# Altium project B100.PrjPcb (part 3 of 3)

## Sheet FOTA MicroController.SchDoc: FOTA MicroController
size A3; ApprovedBy: Mehmet Günce Akkoyun; CheckedBy: Mehmet Günce Akkoyun; Author: Mehmet Günce Akkoyun; CompanyName: Ovoo Electronics; DrawnBy: Mehmet Günce Akkoyun; Engineer: Mehmet Günce Akkoyun; Organization: Ovoo Electronics; Address1: Necip Fazýl Mah. Ortaýrmak Sok.; Address2: Birgül Apt. No: 19/6; Address3: Meram / Konya; Address4: Turkiye; DocumentNumber: 45; Revision: R06; SheetNumber: 45; SheetTotal: 54
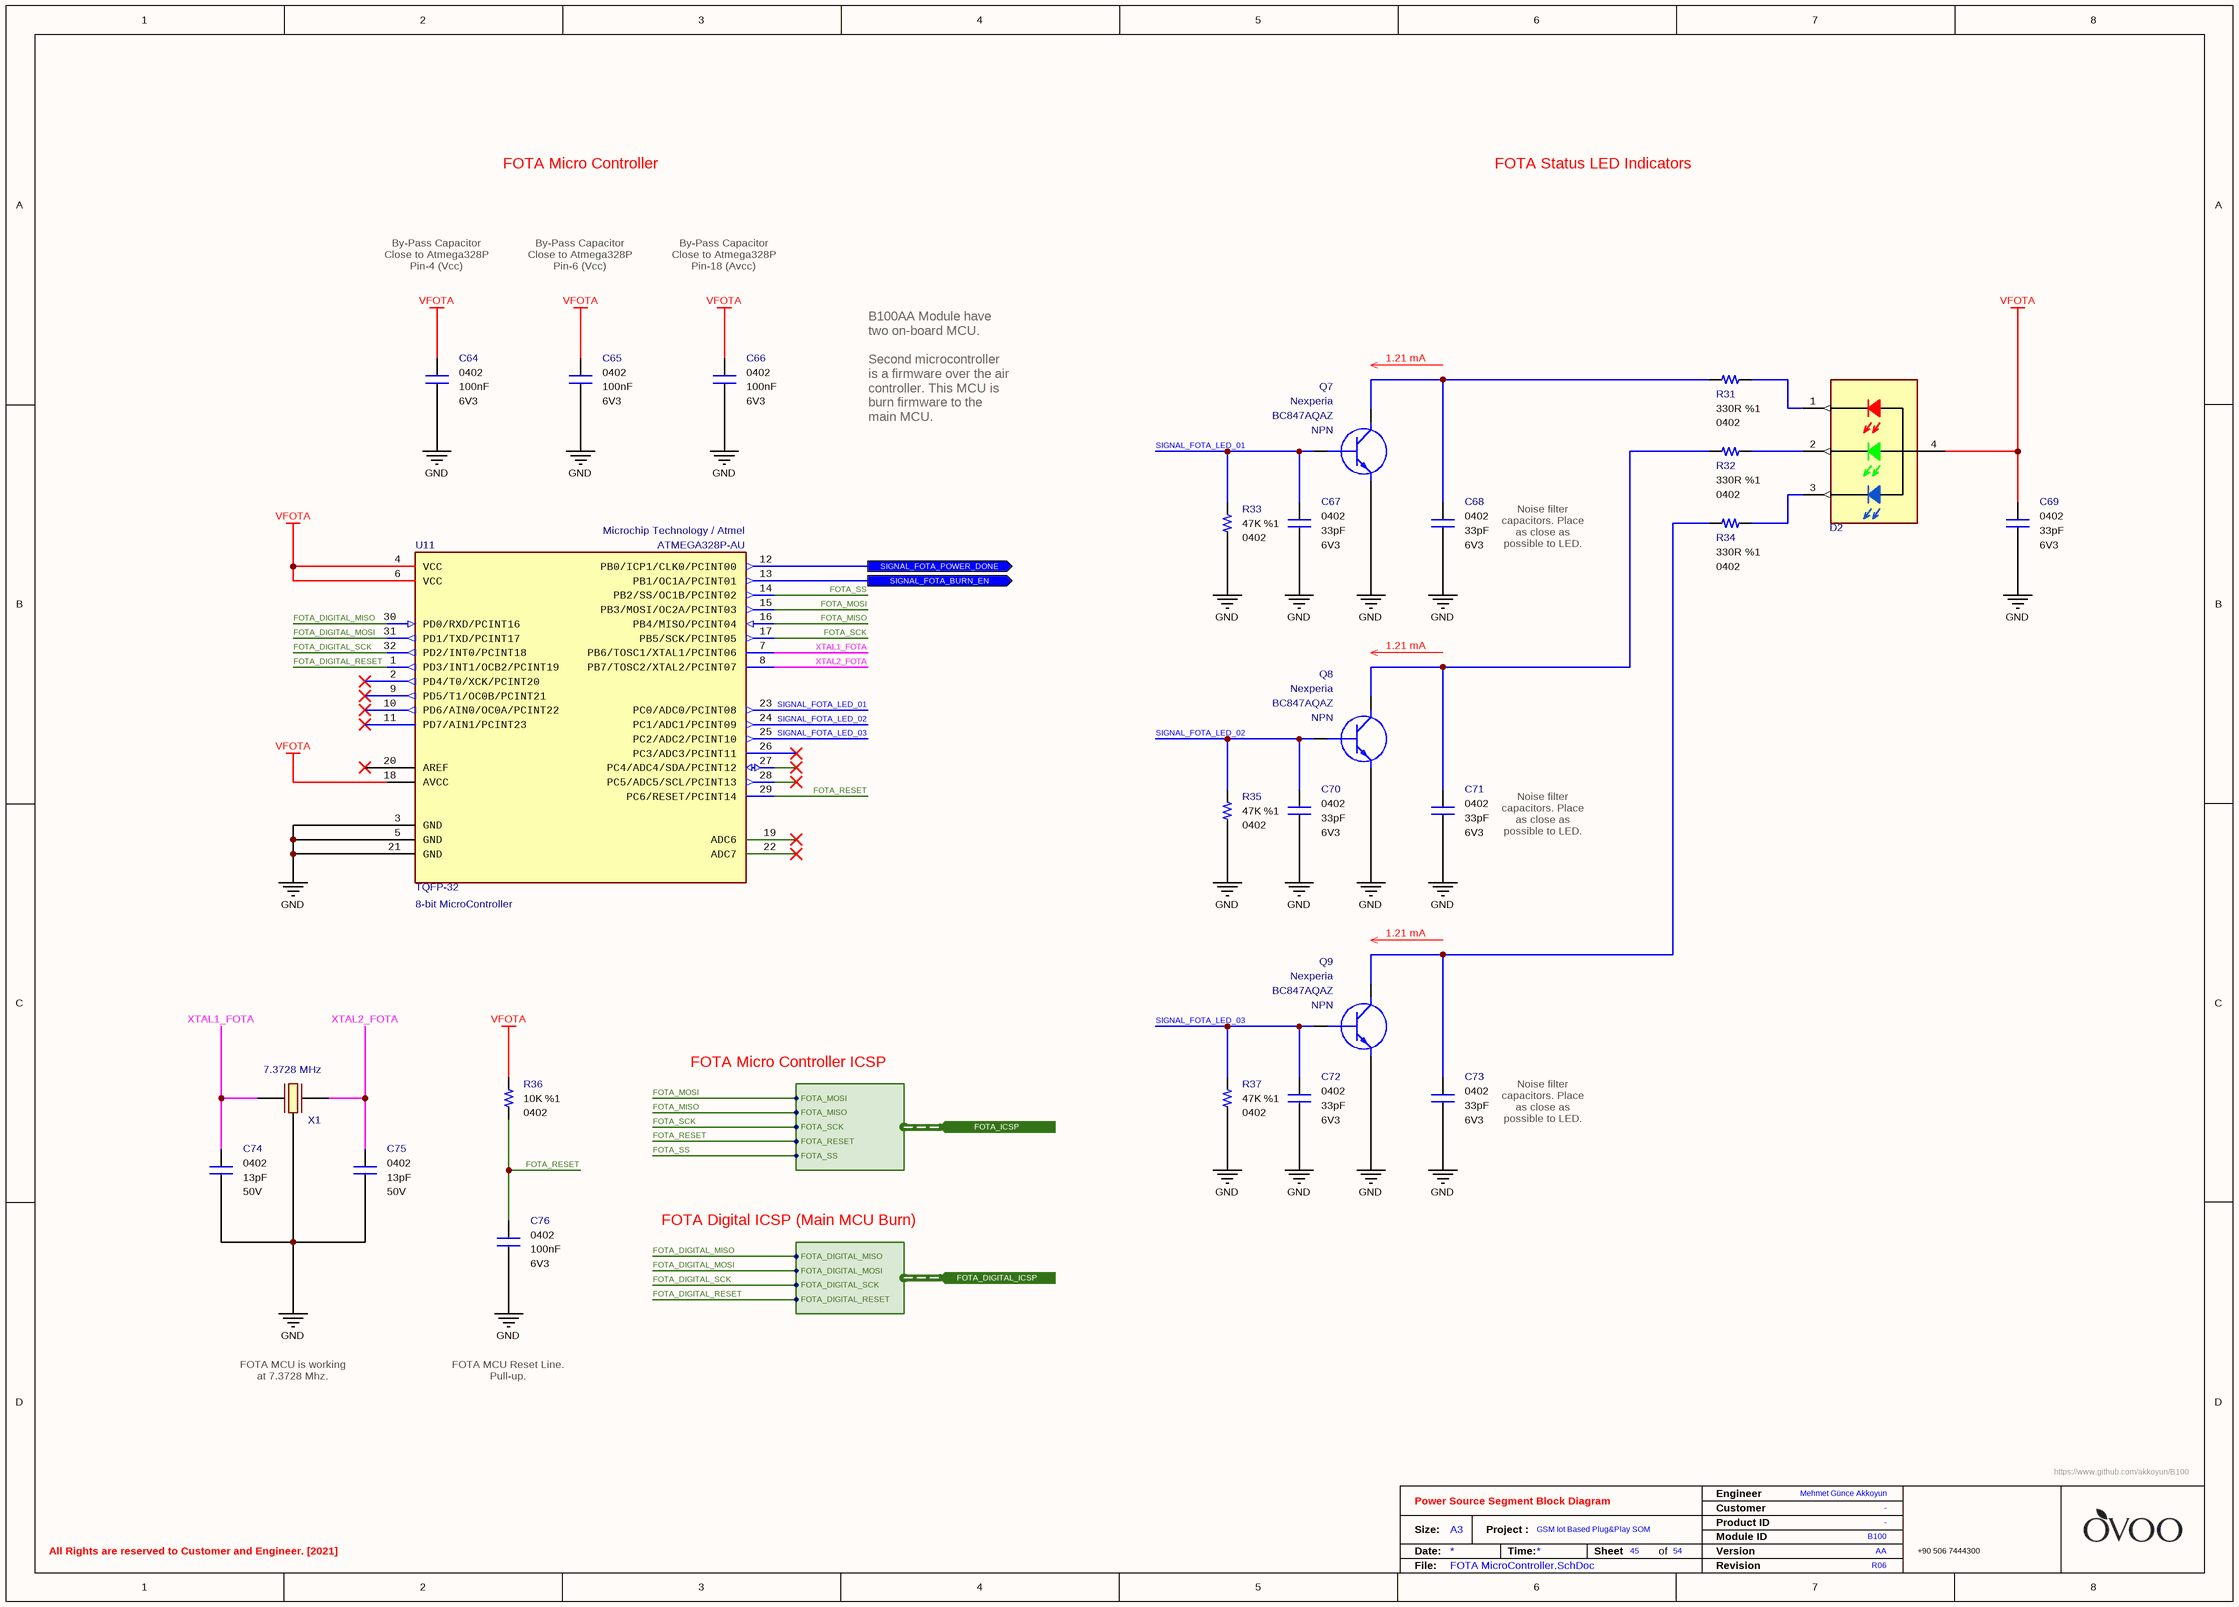
[diagram p21: FOTA MicroController.SchDoc]

### Parts
C64  value 100nF  Case: 0402  Voltage: 6V3  [CAPACITOR_0402]  (hidden comment: Multilayer Ceramic Capacitor)
C65  value 100nF  Case: 0402  Voltage: 6V3  [CAPACITOR_0402]  (hidden comment: Multilayer Ceramic Capacitor)
C66  value 100nF  Case: 0402  Voltage: 6V3  [CAPACITOR_0402]  (hidden comment: Multilayer Ceramic Capacitor)
C67  value 33pF  Case: 0402  Voltage: 6V3  [CAPACITOR_0402]  (hidden comment: Multilayer Ceramic Capacitor)
C68  value 33pF  Case: 0402  Voltage: 6V3  [CAPACITOR_0402]  (hidden comment: Multilayer Ceramic Capacitor)
C69  value 33pF  Case: 0402  Voltage: 6V3  [CAPACITOR_0402]  (hidden comment: Multilayer Ceramic Capacitor)
C70  value 33pF  Case: 0402  Voltage: 6V3  [CAPACITOR_0402]  (hidden comment: Multilayer Ceramic Capacitor)
C71  value 33pF  Case: 0402  Voltage: 6V3  [CAPACITOR_0402]  (hidden comment: Multilayer Ceramic Capacitor)
C72  value 33pF  Case: 0402  Voltage: 6V3  [CAPACITOR_0402]  (hidden comment: Multilayer Ceramic Capacitor)
C73  value 33pF  Case: 0402  Voltage: 6V3  [CAPACITOR_0402]  (hidden comment: Multilayer Ceramic Capacitor)
C74  value 13pF  Voltage: 50V  Case: 0402  [CAPACITOR_0402]  (hidden comment: Multilayer Ceramic Capacitor)
C75  value 13pF  Voltage: 50V  Case: 0402  [CAPACITOR_0402]  (hidden comment: Multilayer Ceramic Capacitor)
C76  value 100nF  Case: 0402  Voltage: 6V3  [CAPACITOR_0402]  (hidden comment: Multilayer Ceramic Capacitor)
D2  150066M153000  [Wurth_0606]  (value not drawn)
Q7  Manufacturer_Name: Nexperia  Manufacturer_Part_Number: BC847AQAZ  Polarity: NPN  [SOT1215]  (hidden comment: Bipolar NPN Transistors)
Q8  Manufacturer_Name: Nexperia  Manufacturer_Part_Number: BC847AQAZ  Polarity: NPN  [SOT1215]  (hidden comment: Bipolar NPN Transistors)
Q9  Manufacturer_Name: Nexperia  Manufacturer_Part_Number: BC847AQAZ  Polarity: NPN  [SOT1215]  (hidden comment: Bipolar NPN Transistors)
R31  value 330R  Tolerance: %1  Case: 0402  [RESISTOR_0402]  (hidden comment: Thick Film Resistor)
R32  value 330R  Tolerance: %1  Case: 0402  [RESISTOR_0402]  (hidden comment: Thick Film Resistor)
R33  value 47K  Tolerance: %1  Case: 0402  [RESISTOR_0402]  (hidden comment: Thick Film Resistor)
R34  value 330R  Tolerance: %1  Case: 0402  [RESISTOR_0402]  (hidden comment: Thick Film Resistor)
R35  value 47K  Tolerance: %1  Case: 0402  [RESISTOR_0402]  (hidden comment: Thick Film Resistor)
R36  value 10K  Tolerance: %1  Case: 0402  [RESISTOR_0402]  (hidden comment: Thick Film Resistor)
R37  value 47K  Tolerance: %1  Case: 0402  [RESISTOR_0402]  (hidden comment: Thick Film Resistor)
U11  8-bit MicroController  Case: TQFP-32  Manufacturer Part Number: ATMEGA328P-AU  Manufacturer Name: Microchip Technology / Atmel  [TQFP32]
X1  7.3728 MHz  [ABRACON_CRYSTAL]

### Ports
FOTA_DIGITAL_ICSP (in, harness FOTA_DIGITAL_ICSP), FOTA_ICSP (in, harness FOTA_ICSP), SIGNAL_FOTA_BURN_EN (out), SIGNAL_FOTA_POWER_DONE (out)

### Harnesses
FOTA_ICSP: FOTA_RESET, FOTA_SCK, FOTA_MISO, FOTA_MOSI, FOTA_SS
FOTA_DIGITAL_ICSP: FOTA_DIGITAL_SCK, FOTA_DIGITAL_MOSI, FOTA_DIGITAL_MISO, FOTA_DIGITAL_RESET

### Nets
GND: C64.1 C65.1 C66.1 C67.2 C68.2 C69.2 C70.2 C71.2 C72.2 C73.2 C74.1 C75.1 C76.1 Q7.2(E) Q8.2(E) Q9.2(E) R33.1 R35.1 R37.1 U11.3(GND) U11.5(GND) U11.21(GND) X1.2(GND)
VFOTA: C64.2 C65.2 C66.2 C69.1 D2.4 R36.2 U11.4(VCC) U11.6(VCC) U11.18(AVCC)
FOTA_DIGITAL_MISO: U11.30(PD0/RXD/PCINT16) ; port FOTA_DIGITAL_ICSP.FOTA_DIGITAL_MISO
FOTA_DIGITAL_MOSI: U11.31(PD1/TXD/PCINT17) ; port FOTA_DIGITAL_ICSP.FOTA_DIGITAL_MOSI
FOTA_DIGITAL_RESET: U11.1(PD3/INT1/OCB2/PCINT19) ; port FOTA_DIGITAL_ICSP.FOTA_DIGITAL_RESET
FOTA_DIGITAL_SCK: U11.32(PD2/INT0/PCINT18) ; port FOTA_DIGITAL_ICSP.FOTA_DIGITAL_SCK
FOTA_MISO: U11.16(PB4/MISO/PCINT04) ; port FOTA_ICSP.FOTA_MISO
FOTA_MOSI: U11.15(PB3/MOSI/OC2A/PCINT03) ; port FOTA_ICSP.FOTA_MOSI
FOTA_RESET: C76.2 R36.1 U11.29(PC6/RESET/PCINT14) ; port FOTA_ICSP.FOTA_RESET
FOTA_SCK: U11.17(PB5/SCK/PCINT05) ; port FOTA_ICSP.FOTA_SCK
FOTA_SS: U11.14(PB2/SS/OC1B/PCINT02) ; port FOTA_ICSP.FOTA_SS
SIGNAL_FOTA_LED_01: C67.1 Q7.1(B) R33.2 U11.23(PC0/ADC0/PCINT08)
SIGNAL_FOTA_LED_02: C70.1 Q8.1(B) R35.2 U11.24(PC1/ADC1/PCINT09)
SIGNAL_FOTA_LED_03: C72.1 Q9.1(B) R37.2 U11.25(PC2/ADC2/PCINT10)
XTAL1_FOTA: C74.2 U11.7(PB6/TOSC1/XTAL1/PCINT06) X1.3(OUT/IN)
XTAL2_FOTA: C75.2 U11.8(PB7/TOSC2/XTAL2/PCINT07) X1.1(IN/OUT)
NetC68_1: C68.1 Q7.3(C) R31.1
NetC71_1: C71.1 Q8.3(C) R32.1
NetC73_1: C73.1 Q9.3(C) R34.1
NetD2_1: D2.1 R31.2
NetD2_2: D2.2 R32.2
NetD2_3: D2.3 R34.2
NetU11_12: U11.12(PB0/ICP1/CLK0/PCINT00) ; port SIGNAL_FOTA_POWER_DONE
NetU11_13: U11.13(PB1/OC1A/PCINT01) ; port SIGNAL_FOTA_BURN_EN

Not connected (* = marked no-connect by the designer): U11 2(PD4/T0/XCK/PCINT20)* 9(PD5/T1/OC0B/PCINT21)* 10(PD6/AIN0/OC0A/PCINT22)* 11(PD7/AIN1/PCINT23)* 19(ADC6)* 20(AREF)* 22(ADC7)* 26(PC3/ADC3/PCINT11)* 27(PC4/ADC4/SDA/PCINT12)* 28(PC5/ADC5/SCL/PCINT13)*; X1 4(GND)

### Notes on the sheet
- FOTA Micro Controller
- FOTA Status LED Indicators
- By-Pass Capacitor
  Close to Atmega328P
  Pin-4 (Vcc)
- By-Pass Capacitor
  Close to Atmega328P
  Pin-6 (Vcc)
- By-Pass Capacitor
  Close to Atmega328P
  Pin-18 (Avcc)
- 1.21 mA
- B100AA Module have two on-board MCU.
  Second microcontroller is a firmware over the air controller. This MCU is burn firmware to the main MCU.
- Noise filter capacitors. Place as close as possible to LED.
- FOTA Micro Controller ICSP
- FOTA Digital ICSP (Main MCU Burn)
- FOTA MCU is working at 7.3728 Mhz.
- FOTA MCU Reset Line. Pull-up.
- Engineer
- All Rights are reserved to Customer and Engineer. [2021]
- Size:
- Date:
- A3
- Project :
- Time:
- Sheet
- of
- Customer
- Product ID
- Module ID
- Version
- File:
- Revision

### Library data of the parts
C64-C66 C76 = Capacitor - 100nF [0402-6V3]: Capacitor - 100nF [0402-6V3] (Ceramic); Manufacturer Name: AVX; Manufacturer Part Number: 04026D104KAT4A; Dielectric: X5R; Tolerance: %10; Height: 0.25mm; ComponentLink1Description: Mouser; ComponentLink1URL: https://www.mouser.com.tr/ProductDetail/AVX/04026D104KAT4A?qs=sGAEpiMZZMs0AnBnWHyRQPg4iYkCw7IMED%2F4kpqgf7w%3D; ComponentLink2Description: DataSheet; ComponentLink2URL: https://www.mouser.com.tr/datasheet/2/40/cx5r-776519.pdf; ROHS: Yes; Maximum Operating Temperature: +85; Minimum Operating Temperature: -55; Supplier 1: Avnet; Supplier Part Number 1: 04026D104KAT4A; Mouser Part Number: 581-04026D104KAT4A
C67-C73 = Capacitor - 33pF [0402-6V3]: Capacitor - 33pF [0402] (Ceramic); Manufacturer Name: Kemet; Manufacturer Part Number: C0402C330J9RACAUTO; Dielectric: X7R; Tolerance: 10%; Height: 0.5mm; Maximum Operating Temperature: +125; Minimum Operating Temperature: -55; ROHS: Yes; ComponentLink1Description: DataSheet; ComponentLink1URL: https://api.kemet.com/component-edge/download/datasheet/C0402C330J9RACAUTO.pdf; ComponentLink2Description: Mouser; ComponentLink2URL: https://www.mouser.com/Search/Refine.aspx?Keyword=80-C0402C330J9RAUTO; Supplier 1: Mouser; Supplier Part Number 1: 80-C0402C330J9RAUTO; Mouser Part Number: 80-C0402C330J9RAUTO
C74 C75 = Capacitor - 13pF [0402-50V]: Capacitor - 13pF [0402] (Ceramic); Manufacturer Name: Kemet; Manufacturer Part Number: CBR04C130F5GAC; Dielectric: C0G; Tolerance: 1%; Height: 0.55mm; ROHS: Yes; Weight: 0.65mg; ComponentLink1Description: DataSheet; ComponentLink1URL: http://www.kemet.com/Lists/ProductCatalog/Attachments/490/KEM_C1030_CBR_SMD.pdf; ComponentLink2Description: Mouser; ComponentLink2URL: http://www.mouser.com/Search/ProductDetail.aspx?qs=kSX8PZDGYstn%252bRHasf81FA%3d%3d; Supplier 1: Mouser; Supplier 2: Farnell; Supplier 3: Digi-Key; Supplier Part Number 3: 399-8812-1-ND; Supplier Part Number 2: 2773390; Supplier Part Number 1: 80-CBR04C130F5GAC; Mouser Part Number: 80-CBR04C130F5GAC
D2 = Diode - RGB LED (150066M153000): Standard LEDs - SMD PICOLED series Red LED; Manufacturer Name: Wurth Elektronik; Datasheet Link: https://www.mouser.com.tr/datasheet/2/445/150066M153000-1715259.pdf; Manufacturer Part Number: 150066M153000; Mouser Part Number: 710-150066M153000; Mouser Price/Stock: https://www.mouser.com.tr/ProductDetail/ROHM-Semiconductor/SML-P12U2TT86R?qs=sGAEpiMZZMseGfSY3csMkRIBDsfU3UCXJTULB5gem9Ta%252Bp%252BvZ709fg%3D%3D; Case: 0606; ROHS: Yes; Supplier 1: RSComponents; Supplier 2: RSComponents; Supplier 3: Mouser; Supplier 4: Farnell; Supplier 5: Digi-Key; Supplier 6: Digi-Key; Supplier 7: Digi-Key; Supplier 8: Newark; Supplier Part Number 1: 1765006; Supplier Part Number 2: 1766050; Supplier Part Number 3: 710-150066M153000; Supplier Part Number 4: 2764964; Supplier Part Number 5: 732-11390-1-ND; Supplier Part Number 6: 732-11390-6-ND; Supplier Part Number 7: 732-11390-2-ND; Supplier Part Number 8: 22AC3253
Q7-Q9 = Transistor - BC847: Bipolar Transistors - BJT BC847AQA/DFN1010D-3/REEL 7" Q2; Mouser_Part_Number: 771-BC847AQAZ; ComponentLink1Description: DataSheet; ComponentLink1URL: https://www.mouser.com.tr/datasheet/2/916/BC847XQA_SER-1598405.pdf; ComponentLink2Description: Mouser; ComponentLink2URL: https://www.mouser.com.tr/ProductDetail/Nexperia/BC847AQAZ?qs=%2Fha2pyFaduhKMCPKNtQimeJpXTw9z4AqURd2YARs8DVICZNv3AT9Dw%3D%3D; Case: DFN-1010D-3; Supplier 1: Mouser; Supplier 2: Digi-Key; Supplier Part Number 1: 771-BC847AQAZ; Supplier Part Number 2: 1727-2545-1-ND
R31 R32 R34 = Resistor - 330R: Thick Film Resistors - SMD 1/16 W 330 Ohm 1%; Manufacturer Name: Vishay; Manufacturer Part Number: CRCW0402330RFKED; Height: 0.4mm; ComponentLink1Description: DataSheet; ComponentLink1URL: https://www.mouser.com.tr/datasheet/2/427/dcrcwe3-1762152.pdf; ComponentLink2Description: Mouser; ComponentLink2URL: https://www.mouser.com.tr/ProductDetail/Vishay-Dale/CRCW0402330RFKED?qs=sGAEpiMZZMu61qfTUdNhG2DpbjADlD3GGS6SwBlLi5Q%3D; Supplier 1: Mouser; Supplier 2: Digi-Key; Supplier Part Number 2: 541-330LCT-ND; Supplier Part Number 1: 71-CRCW0402-330-E3; Mouser Part Number: 71-CRCW0402-330-E3
R33 R35 R37 = Resistor - 47K: Thick Film Resistors - SMD 1/16 W 47 Kohms 1%; Manufacturer Name: Vishay; Manufacturer Part Number: CRCW040247K0FKED; Height: 0.4mm; ComponentLink1Description: DataSheet; ComponentLink1URL: https://www.mouser.com.tr/datasheet/2/427/dcrcwe3-1762152.pdf; ComponentLink2Description: Mouser; ComponentLink2URL: https://www.mouser.com.tr/ProductDetail/Vishay-Dale/CRCW040247K0FKED?qs=sGAEpiMZZMu61qfTUdNhG2DpbjADlD3GL%252B3h1elTxqU%3D; Supplier 1: Mouser; Supplier 2: Digi-Key; Supplier Part Number 1: 71-CRCW040247K0FKEDH; Supplier Part Number 2: 541-47.0KYCT-ND; Mouser Part Number: 71-CRCW0402-47K-E3
R36 = Resistor - 10K: Thick Film Resistors - SMD 1/16 W 10 Kohms 1%; Manufacturer Name: Vishay; Manufacturer Part Number: CRCW040210K0FKED; Height: 0.4mm; ComponentLink1Description: DataSheet; ComponentLink1URL: https://www.mouser.com.tr/datasheet/2/427/dcrcwe3-1762152.pdf; ComponentLink2Description: Mouser; ComponentLink2URL: https://www.mouser.com.tr/ProductDetail/Vishay-Dale/CRCW040210K0FKED?qs=sGAEpiMZZMu61qfTUdNhG2DpbjADlD3GcalbOv9utCY%3D; Supplier 1: Mouser; Supplier 2: Digi-Key; Supplier Part Number 1: 71-CRCW040210K0FKEDH; Supplier Part Number 2: 541-10.0KYCT-ND; Mouser Part Number: 71-CRCW0402-10K-E3
U11 = IC - ATMEGA328P: 8-bit Microcontrollers - MCU 32KB In-system Flash 20MHz 1.8V-5.5V; Supply Voltage - Min: 1.8V; Supply Voltage - Max: 5.5V; Height: 1mm; ComponentLink1Description: DataSheet; ComponentLink1URL: http://ww1.microchip.com/downloads/en/DeviceDoc/ATmega48A-PA-88A-PA-168A-PA-328-P-DS-DS40002061A.pdf; ROHS: Yes; Minimum Operating Temperature: -40; Maximum Operating Temperature: +85; ComponentLink2Description: Mouser; ComponentLink2URL: https://www.mouser.com.tr/ProductDetail/Microchip-Technology-Atmel/ATMEGA328P-AU?qs=sGAEpiMZZMtVoztFdqDXO3RbBx7FKCmV; ComponentLink3Description: ProductPage; ComponentLink3URL: https://www.microchip.com/wwwproducts/en/ATmega328p; Supplier 1: Avnet; Supplier 2: Mouser; Supplier 3: Arrow; Supplier 4: Digi-Key; Supplier Part Number 1: ATMEGA328P-AU; Supplier Part Number 2: 556-ATMEGA328P-AU; Supplier Part Number 3: ATMEGA328P-AU; Supplier Part Number 4: ATMEGA328P-AU-ND; Mouser Part Number: 556-ATMEGA328P-AU
X1 = Crystal - 7.3728 MHz (Abracon): Crystals 7.3728MHz 18pF -40C +85C; Manufacturer Part Number: ABMM2-7.3728MHZ-E2-T; ESR: 150 Ohms; Frequency Stability: 20 ppm; Height: 1.2 mm; Frequency: 7.3728 MHz; Maximum Operating Temperature: +70; Minimum Operating Temperature: -20; ROHS: Yes; Tolerance: 20 ppm; ComponentLink1Description: DataSheet; ComponentLink1URL: https://www.ecsxtal.com/store/pdf/csm-8mr.pdf; ComponentLink2Description: Mouser; ComponentLink2URL: https://www.mouser.com/Search/Refine.aspx?Keyword=520-7.3-18-20BM-JENT; Supplier 1: Mouser; Supplier 2: Arrow; Supplier Part Number 2: ABMM2-7.3728MHZ-E2-T; Supplier Part Number 1: 815-ABMM2-7.3-E2-T; Manufacturer Name: ABRACON; Mouser Part Number: 815-ABMM2-7.3-E2-T; Case: SMD

## Sheet SD Card.SchDoc: SD Card & Select Switch
size A4; ApprovedBy: Mehmet Günce Akkoyun; CheckedBy: Mehmet Günce Akkoyun; Author: Mehmet Günce Akkoyun; CompanyName: Ovoo Electronics; DrawnBy: Mehmet Günce Akkoyun; Engineer: Mehmet Günce Akkoyun; Organization: Ovoo Electronics; Address1: Necip Fazýl Mah. Ortaýrmak Sok.; Address2: Birgül Apt. No: 19/6; Address3: Meram / Konya; Address4: Turkiye; DocumentNumber: 46; Revision: R06; SheetNumber: 46; SheetTotal: 54
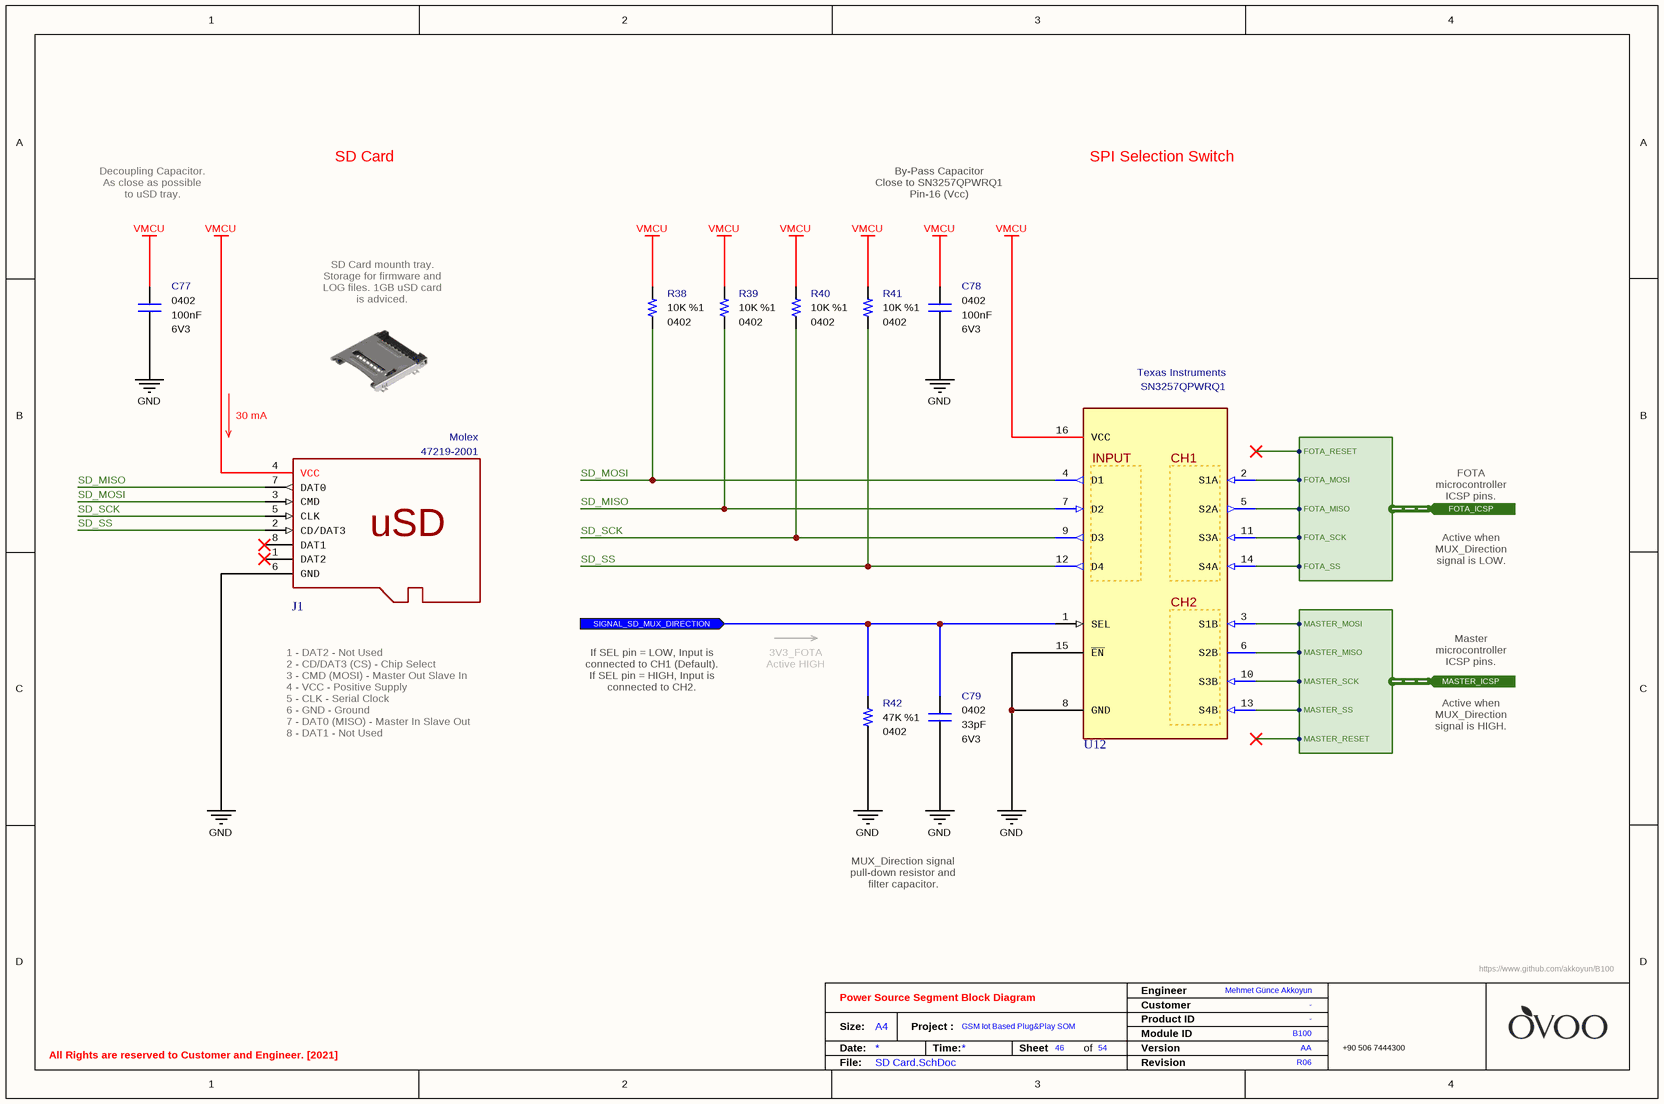
[diagram p22: SD Card.SchDoc]

### Parts
C77  value 100nF  Case: 0402  Voltage: 6V3  [CAPACITOR_0402]  (hidden comment: Multilayer Ceramic Capacitor)
C78  value 100nF  Case: 0402  Voltage: 6V3  [CAPACITOR_0402]  (hidden comment: Multilayer Ceramic Capacitor)
C79  value 33pF  Case: 0402  Voltage: 6V3  [CAPACITOR_0402]  (hidden comment: Multilayer Ceramic Capacitor)
J1  Manufacturer Part Number: 47219-2001  Manufacturer Name: Molex  [Connector - SD Module]  (hidden comment: Memory Card Connectors)
R38  value 10K  Tolerance: %1  Case: 0402  [RESISTOR_0402]  (hidden comment: Thick Film Resistor)
R39  value 10K  Tolerance: %1  Case: 0402  [RESISTOR_0402]  (hidden comment: Thick Film Resistor)
R40  value 10K  Tolerance: %1  Case: 0402  [RESISTOR_0402]  (hidden comment: Thick Film Resistor)
R41  value 10K  Tolerance: %1  Case: 0402  [RESISTOR_0402]  (hidden comment: Thick Film Resistor)
R42  value 47K  Tolerance: %1  Case: 0402  [RESISTOR_0402]  (hidden comment: Thick Film Resistor)
U12  Manufacturer Part Number: SN3257QPWRQ1  Manufacturer Name: Texas Instruments  [TSSOP-16]  (hidden comment: SPI Switch IC)

### Ports
FOTA_ICSP (in, harness FOTA_ICSP), MASTER_ICSP (in, harness MASTER_ICSP), SIGNAL_SD_MUX_DIRECTION (in)

### Harnesses
FOTA_ICSP: FOTA_RESET, FOTA_SCK, FOTA_MISO, FOTA_MOSI, FOTA_SS
MASTER_ICSP: MASTER_RESET, MASTER_SCK, MASTER_MISO, MASTER_MOSI, MASTER_SS

### Nets
GND: C77.1 C78.2 C79.1 J1.6(GND) R42.1 U12.8(GND) U12.15(~{EN})
VMCU: C77.2 C78.1 J1.4(VCC) R38.2 R39.2 R40.2 R41.2 U12.16(VCC)
SD_MISO: J1.7(DAT0) R39.1 U12.7(D2)
SD_MOSI: J1.3(CMD) R38.1 U12.4(D1)
SD_SCK: J1.5(CLK) R40.1 U12.9(D3)
SD_SS: J1.2(CD/DAT3) R41.1 U12.12(D4)
NetC79_2: C79.2 R42.2 U12.1(SEL) ; port SIGNAL_SD_MUX_DIRECTION
NetU12_2: U12.2(S1A) ; port FOTA_ICSP.FOTA_MOSI
NetU12_3: U12.3(S1B) ; port MASTER_ICSP.MASTER_MOSI
NetU12_5: U12.5(S2A) ; port FOTA_ICSP.FOTA_MISO
NetU12_6: U12.6(S2B) ; port MASTER_ICSP.MASTER_MISO
NetU12_10: U12.10(S3B) ; port MASTER_ICSP.MASTER_SCK
NetU12_11: U12.11(S3A) ; port FOTA_ICSP.FOTA_SCK
NetU12_13: U12.13(S4B) ; port MASTER_ICSP.MASTER_SS
NetU12_14: U12.14(S4A) ; port FOTA_ICSP.FOTA_SS

Not connected (* = marked no-connect by the designer): J1 1(DAT2)* 8(DAT1)*

### Notes on the sheet
- SD Card
- SPI Selection Switch
- Decoupling Capacitor. As close as possible to uSD tray.
- By-Pass Capacitor
  Close to SN3257QPWRQ1
  Pin-16 (Vcc)
- SD Card mounth tray. Storage for firmware and LOG files. 1GB uSD card is adviced.
- 30 mA
- FOTA microcontroller
  ICSP pins.
- Active when MUX_Direction signal is LOW.
- If SEL pin = LOW, Input is connected to CH1 (Default).
  If SEL pin = HIGH, Input is connected to CH2.
- (near R42) 3V3_FOTA
  Active HIGH
- Master microcontroller
  ICSP pins.
- 1 - DAT2 - Not Used
  2 - CD/DAT3 (CS) - Chip Select
  3 - CMD (MOSI) - Master Out Slave In
  4 - VCC - Positive Supply
  5 - CLK - Serial Clock
  6 - GND - Ground
  7 - DAT0 (MISO) - Master In Slave Out
  8 - DAT1 - Not Used
- Active when MUX_Direction signal is HIGH.
- MUX_Direction signal pull-down resistor and filter capacitor.
- Engineer
- All Rights are reserved to Customer and Engineer. [2021]
- Size:
- Date:
- A4
- Project :
- Time:
- Sheet
- of
- Customer
- Product ID
- Module ID
- Version
- File:
- Revision
- (in symbol Connector - SD Slot) uSD
- (in symbol IC - SN3257QPWRQ1) INPUT; CH1; CH2

### Library data of the parts
C77 C78 = Capacitor - 100nF [0402-6V3]: as C64-C66 on sheet FOTA MicroController; Height: 0.25mm; ComponentLink1Description: Mouser; ComponentLink1URL: https://www.mouser.com.tr/ProductDetail/AVX/04026D104KAT4A?qs=sGAEpiMZZMs0AnBnWHyRQPg4iYkCw7IMED%2F4kpqgf7w%3D; ComponentLink2Description: DataSheet; ComponentLink2URL: https://www.mouser.com.tr/datasheet/2/40/cx5r-776519.pdf; ROHS: Yes; Maximum Operating Temperature: +85; Minimum Operating Temperature: -55; Supplier 1: Avnet; Supplier Part Number 1: 04026D104KAT4A; Mouser Part Number: 581-04026D104KAT4A
C79 = Capacitor - 33pF [0402-6V3]: as C67-C73 on sheet FOTA MicroController; Height: 0.5mm; Maximum Operating Temperature: +125; Minimum Operating Temperature: -55; ROHS: Yes; ComponentLink1Description: DataSheet; ComponentLink1URL: https://api.kemet.com/component-edge/download/datasheet/C0402C330J9RACAUTO.pdf; ComponentLink2Description: Mouser; ComponentLink2URL: https://www.mouser.com/Search/Refine.aspx?Keyword=80-C0402C330J9RAUTO; Supplier 1: Mouser; Supplier Part Number 1: 80-C0402C330J9RAUTO; Mouser Part Number: 80-C0402C330J9RAUTO
J1 = Connector - SD Slot: Memory Card Connectors TFR READER (HINGE TYPE); Card Type: microSD; Supplier 1: Avnet; Supplier 2: Farnell; Supplier 3: Newark; Supplier 4: Digi-Key; Supplier Part Number 2: 2614940; Supplier Part Number 1: 0472192001; Supplier Part Number 3: 32T4523; Supplier Part Number 4: WM6698CT-ND; Mouser Part Number: 538-47219-2001; Case: SMD
R38-R41 = Resistor - 10K: as R36 on sheet FOTA MicroController; Height: 0.4mm; ComponentLink1Description: DataSheet; ComponentLink1URL: https://www.mouser.com.tr/datasheet/2/427/dcrcwe3-1762152.pdf; ComponentLink2Description: Mouser; ComponentLink2URL: https://www.mouser.com.tr/ProductDetail/Vishay-Dale/CRCW040210K0FKED?qs=sGAEpiMZZMu61qfTUdNhG2DpbjADlD3GcalbOv9utCY%3D; Supplier 1: Mouser; Supplier 2: Digi-Key; Supplier Part Number 1: 71-CRCW040210K0FKEDH; Supplier Part Number 2: 541-10.0KYCT-ND; Mouser Part Number: 71-CRCW0402-10K-E3
R42 = Resistor - 47K: as R33 on sheet FOTA MicroController; Height: 0.4mm; ComponentLink1Description: DataSheet; ComponentLink1URL: https://www.mouser.com.tr/datasheet/2/427/dcrcwe3-1762152.pdf; ComponentLink2Description: Mouser; ComponentLink2URL: https://www.mouser.com.tr/ProductDetail/Vishay-Dale/CRCW040247K0FKED?qs=sGAEpiMZZMu61qfTUdNhG2DpbjADlD3GL%252B3h1elTxqU%3D; Supplier 1: Mouser; Supplier 2: Digi-Key; Supplier Part Number 1: 71-CRCW040247K0FKEDH; Supplier Part Number 2: 541-47.0KYCT-ND; Mouser Part Number: 71-CRCW0402-47K-E3
U12 = IC - SN3257QPWRQ1: Analogue Switch ICs 2:1 (SPDT), 4-channel switch with 1.8-V logic 16-TSSOP -40 to 125; Mouser Part Number: 595-SN3257QPWRQ1; ComponentLink1Description: DataSheet; ComponentLink1URL: http://www.ti.com/lit/ds/symlink/tca9546a.pdf; ComponentLink2Description: Mouser; ComponentLink2URL: https://eu.mouser.com/ProductDetail/Texas-Instruments/TCA9546APWR?qs=sGAEpiMZZMu0f%252BT2bkVfuqY85%252BzcFu6eZaMCXRqwDMg%3D; Minimum Operating Temperature: -40; Maximum Operating Temperature: +125; Supplier 1: Mouser; Supplier 2: Digi-Key; Supplier Part Number 1: 595-SN3257QPWRQ1; Supplier Part Number 2: 296-SN3257QPWRQ1CT-ND; Case: TSSOP-16

## Sheet ICSP Burn Buffer.SchDoc: FOTA Burn Buffer
size A4; ApprovedBy: Mehmet Günce Akkoyun; CheckedBy: Mehmet Günce Akkoyun; Author: Mehmet Günce Akkoyun; CompanyName: Ovoo Electronics; DrawnBy: Mehmet Günce Akkoyun; Engineer: Mehmet Günce Akkoyun; Organization: Ovoo Electronics; Address1: Necip Fazýl Mah. Ortaýrmak Sok.; Address2: Birgül Apt. No: 19/6; Address3: Meram / Konya; Address4: Turkiye; DocumentNumber: 47; Revision: R06; SheetNumber: 47; SheetTotal: 54
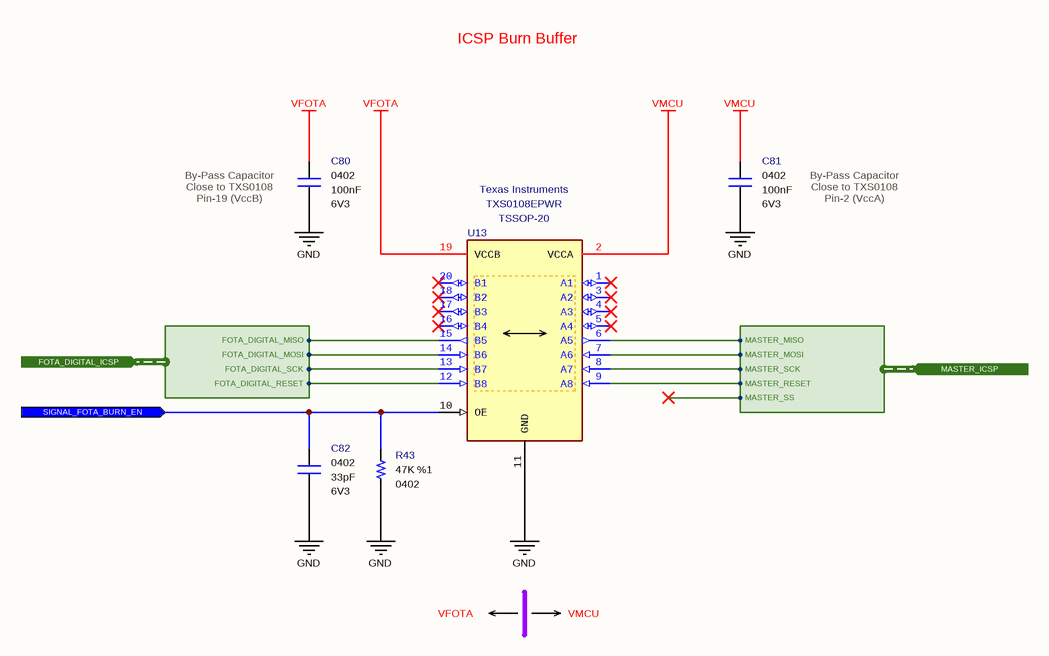
[diagram p23: ICSP Burn Buffer.SchDoc]

### Parts
C80  value 100nF  Case: 0402  Voltage: 6V3  [CAPACITOR_0402]  (hidden comment: Multilayer Ceramic Capacitor)
C81  value 100nF  Case: 0402  Voltage: 6V3  [CAPACITOR_0402]  (hidden comment: Multilayer Ceramic Capacitor)
C82  value 33pF  Case: 0402  Voltage: 6V3  [CAPACITOR_0402]  (hidden comment: Multilayer Ceramic Capacitor)
R43  value 47K  Tolerance: %1  Case: 0402  [RESISTOR_0402]  (hidden comment: Thick Film Resistor)
U13  Manufacturer Part Number: TXS0108EPWR  Manufacturer Name: Texas Instruments  [TSSOP-20]  (hidden comment: Voltage Level Shifter)

### Ports
FOTA_DIGITAL_ICSP (in, harness FOTA_DIGITAL_ICSP), MASTER_ICSP (in, harness MASTER_ICSP), SIGNAL_FOTA_BURN_EN (in)

### Harnesses
FOTA_DIGITAL_ICSP: FOTA_DIGITAL_SCK, FOTA_DIGITAL_MOSI, FOTA_DIGITAL_MISO, FOTA_DIGITAL_RESET
MASTER_ICSP: MASTER_RESET, MASTER_SCK, MASTER_MISO, MASTER_MOSI, MASTER_SS

### Nets
GND: C80.1 C81.1 C82.2 R43.1 U13.11(GND)
VFOTA: C80.2 U13.19(VCCB)
VMCU: C81.2 U13.2(VCCA)
NetC82_1: C82.1 R43.2 U13.10(OE) ; port SIGNAL_FOTA_BURN_EN
NetU13_6: U13.6(A5) ; port MASTER_ICSP.MASTER_MISO
NetU13_7: U13.7(A6) ; port MASTER_ICSP.MASTER_MOSI
NetU13_8: U13.8(A7) ; port MASTER_ICSP.MASTER_SCK
NetU13_9: U13.9(A8) ; port MASTER_ICSP.MASTER_RESET
NetU13_12: U13.12(B8) ; port FOTA_DIGITAL_ICSP.FOTA_DIGITAL_RESET
NetU13_13: U13.13(B7) ; port FOTA_DIGITAL_ICSP.FOTA_DIGITAL_SCK
NetU13_14: U13.14(B6) ; port FOTA_DIGITAL_ICSP.FOTA_DIGITAL_MOSI
NetU13_15: U13.15(B5) ; port FOTA_DIGITAL_ICSP.FOTA_DIGITAL_MISO

Not connected (* = marked no-connect by the designer): U13 1(A1)* 3(A2)* 4(A3)* 5(A4)* 16(B4)* 17(B3)* 18(B2)* 20(B1)*

### Notes on the sheet
- ICSP Burn Buffer
- (near C80) By-Pass Capacitor
  Close to TXS0108
  Pin-19 (VccB)
- By-Pass Capacitor
  Close to TXS0108
  Pin-2 (VccA)
- VFOTA
- VMCU
- Engineer
- All Rights are reserved to Customer and Engineer. [2021]
- Size:
- Date:
- A4
- Project :
- Time:
- Sheet
- of
- Customer
- Product ID
- Module ID
- Version
- File:
- Revision

### Library data of the parts
C80 C81 = Capacitor - 100nF [0402-6V3]: as C64-C66 on sheet FOTA MicroController; Height: 0.25mm; ComponentLink1Description: Mouser; ComponentLink1URL: https://www.mouser.com.tr/ProductDetail/AVX/04026D104KAT4A?qs=sGAEpiMZZMs0AnBnWHyRQPg4iYkCw7IMED%2F4kpqgf7w%3D; ComponentLink2Description: DataSheet; ComponentLink2URL: https://www.mouser.com.tr/datasheet/2/40/cx5r-776519.pdf; ROHS: Yes; Maximum Operating Temperature: +85; Minimum Operating Temperature: -55; Supplier 1: Avnet; Supplier Part Number 1: 04026D104KAT4A; Mouser Part Number: 581-04026D104KAT4A
C82 = Capacitor - 33pF [0402-6V3]: as C67-C73 on sheet FOTA MicroController; Height: 0.5mm; Maximum Operating Temperature: +125; Minimum Operating Temperature: -55; ROHS: Yes; ComponentLink1Description: DataSheet; ComponentLink1URL: https://api.kemet.com/component-edge/download/datasheet/C0402C330J9RACAUTO.pdf; ComponentLink2Description: Mouser; ComponentLink2URL: https://www.mouser.com/Search/Refine.aspx?Keyword=80-C0402C330J9RAUTO; Supplier 1: Mouser; Supplier Part Number 1: 80-C0402C330J9RAUTO; Mouser Part Number: 80-C0402C330J9RAUTO
R43 = Resistor - 47K: as R33 on sheet FOTA MicroController; Height: 0.4mm; ComponentLink1Description: DataSheet; ComponentLink1URL: https://www.mouser.com.tr/datasheet/2/427/dcrcwe3-1762152.pdf; ComponentLink2Description: Mouser; ComponentLink2URL: https://www.mouser.com.tr/ProductDetail/Vishay-Dale/CRCW040247K0FKED?qs=sGAEpiMZZMu61qfTUdNhG2DpbjADlD3GL%252B3h1elTxqU%3D; Supplier 1: Mouser; Supplier 2: Digi-Key; Supplier Part Number 1: 71-CRCW040247K0FKEDH; Supplier Part Number 2: 541-47.0KYCT-ND; Mouser Part Number: 71-CRCW0402-47K-E3
U13 = IC - TXS0108EPW: Translation - Voltage Levels 8B Bidir Vltg-Level Translator; Supply Voltage - Max: 5.5V; Supply Voltage - Min: 1.2V; Height: 1.2mm; Mouser Part Number: 595-TXS0108EPWR; ComponentLink1Description: DataSheet; ComponentLink1URL: https://www.ti.com/lit/ds/symlink/txs0108e.pdf?HQS=dis-mous-null-mousermode-dsf-pf-null-wwe&ts=1609232216318&ref_url=https%253A%252F%252Fwww.mouser.com.tr%252F; Maximum Operating Temperature: +85; Minimum Operating Temperature: -40; ComponentLink2Description: Mouser; ComponentLink2URL: https://www.mouser.com.tr/ProductDetail/Texas-Instruments/TXS0108EPWR/?qs=IUbkBnfnSQLgiWtCbWtYOw%3D%3D; Supplier 2: Mouser; Supplier 3: Digi-Key; Supplier 4: Digi-Key; Supplier 5: Digi-Key; Supplier 6: Farnell; Supplier 7: Farnell; Supplier 8: Farnell; Supplier 9: RSComponents; Supplier 10: RSComponents; Supplier 1: Arrow Electronics; Supplier Part Number 1: TXS0108EPWR; Supplier Part Number 2: 595-TXS0108EPWR; Supplier Part Number 3: 296-23011-1-ND; Supplier Part Number 4: 296-23011-6-ND; Supplier Part Number 5: 296-23011-2-ND; Supplier Part Number 6: 1702548; Supplier Part Number 7: 1702548RL; Supplier Part Number 8: 2437921; Supplier Part Number 9: 7094639P; Supplier Part Number 10: 7094639; Case: TSSOP-20

## Sheet I2C Network.SchDoc: I2C Network Block Diagram
size A3; ApprovedBy: Mehmet Günce Akkoyun; CheckedBy: Mehmet Günce Akkoyun; Author: Mehmet Günce Akkoyun; CompanyName: Ovoo Electronics; DrawnBy: Mehmet Günce Akkoyun; Engineer: Mehmet Günce Akkoyun; Organization: Ovoo Electronics; Address1: Necip Fazýl Mah. Ortaýrmak Sok.; Address2: Birgül Apt. No: 19/6; Address3: Meram / Konya; Address4: Turkiye; DocumentNumber: 49; Revision: R06; SheetNumber: 49; SheetTotal: 54
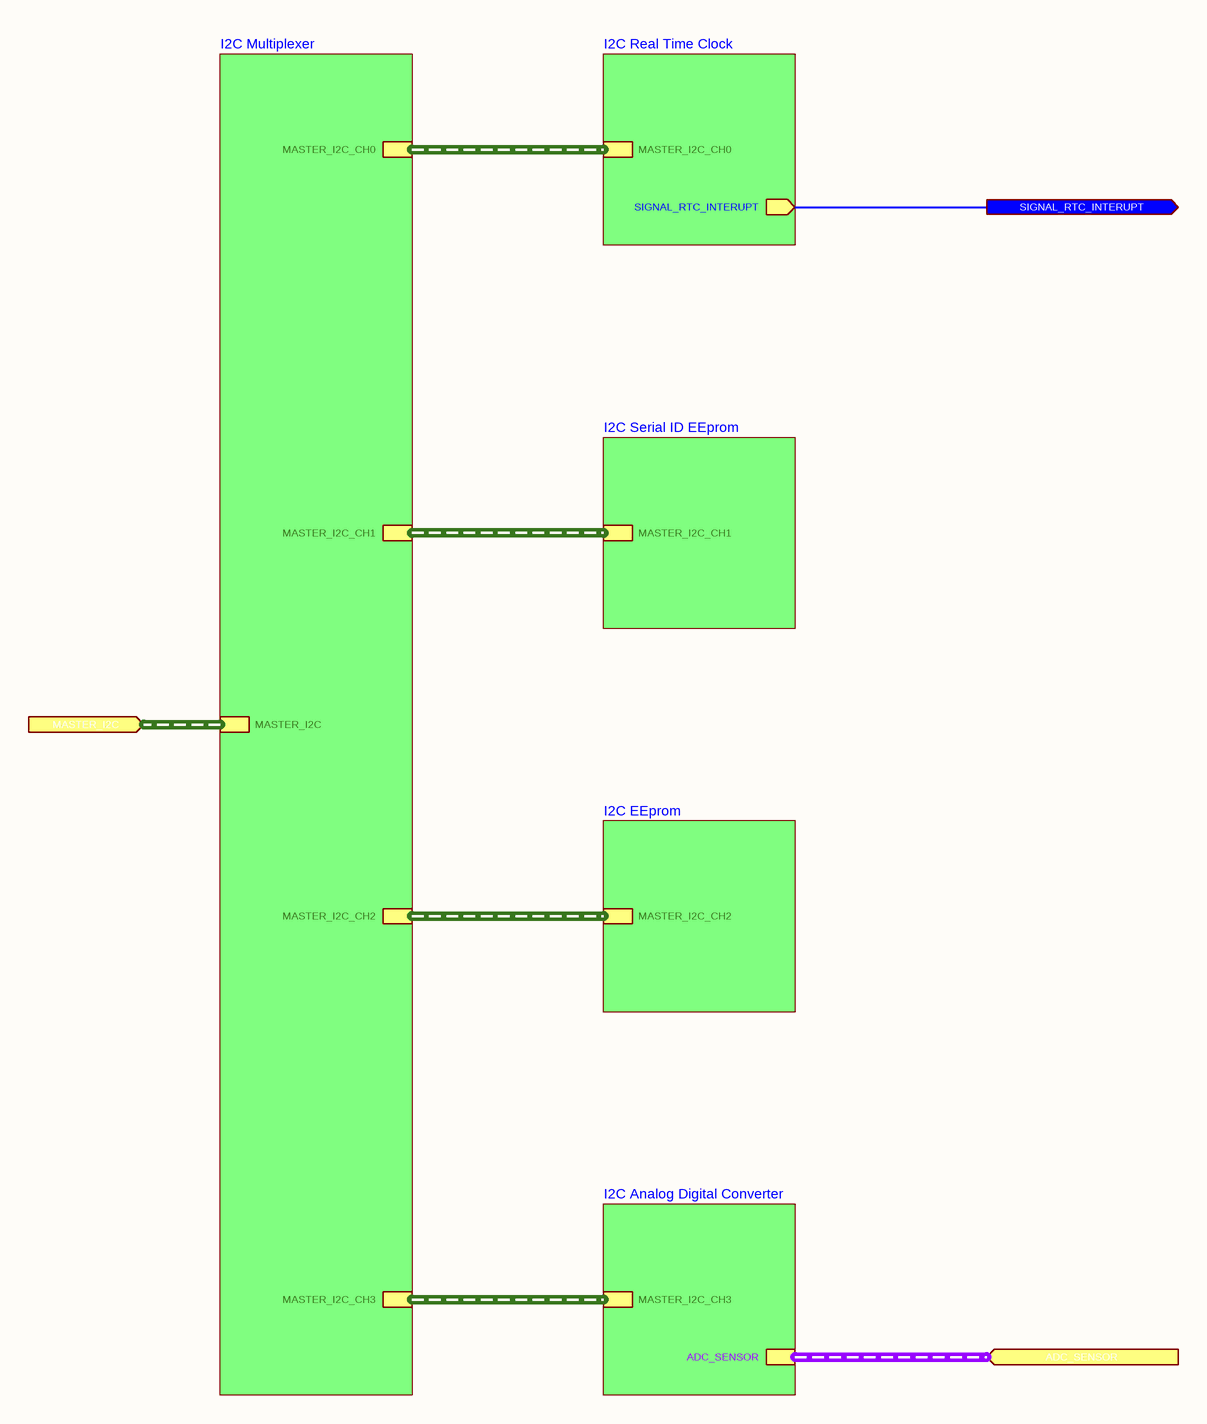
[diagram p24: I2C Network.SchDoc]

### Sub-sheets
I2C Analog Digital Converter = Analog Digital Converter.SchDoc (file not in this document): MASTER_I2C_CH3 (harness MASTER_I2C_CH3), ADC_SENSOR (harness ADC_SENSOR)
I2C EEprom = EEPROM.SchDoc (file not in this document): MASTER_I2C_CH2 (harness MASTER_I2C_CH2)
I2C Multiplexer = I2C Multiplexer.SchDoc (file not in this document): MASTER_I2C_CH1 (harness MASTER_I2C_CH1), MASTER_I2C_CH2 (harness MASTER_I2C_CH2), MASTER_I2C_CH3 (harness MASTER_I2C_CH3), MASTER_I2C_CH0 (harness MASTER_I2C_CH0), MASTER_I2C (harness MASTER_I2C)
I2C Real Time Clock = Real Time Clock.SchDoc: SIGNAL_RTC_INTERUPT (out), MASTER_I2C_CH0 (harness MASTER_I2C_CH0)
I2C Serial ID EEprom = Serial ID EEPROM.SchDoc (file not in this document): MASTER_I2C_CH1 (harness MASTER_I2C_CH1)

### Ports
ADC_SENSOR (in, harness ADC_SENSOR), MASTER_I2C (in, harness MASTER_I2C), SIGNAL_RTC_INTERUPT (out)

### Nets
NetC133_1: port SIGNAL_RTC_INTERUPT, sheet I2C Real Time Clock/SIGNAL_RTC_INTERUPT

### Buses and harness runs
harness port ADC_SENSOR = sheet I2C Analog Digital Converter/ADC_SENSOR
harness port MASTER_I2C = sheet I2C Multiplexer/MASTER_I2C
harness sheet I2C Analog Digital Converter/MASTER_I2C_CH3 = sheet I2C Multiplexer/MASTER_I2C_CH3
harness sheet I2C EEprom/MASTER_I2C_CH2 = sheet I2C Multiplexer/MASTER_I2C_CH2
harness sheet I2C Multiplexer/MASTER_I2C_CH0 = sheet I2C Real Time Clock/MASTER_I2C_CH0
harness sheet I2C Multiplexer/MASTER_I2C_CH1 = sheet I2C Serial ID EEprom/MASTER_I2C_CH1

### Notes on the sheet
- Engineer
- All Rights are reserved to Customer and Engineer. [2021]
- Size:
- Date:
- A3
- Project :
- Time:
- Sheet
- of
- Customer
- Product ID
- Module ID
- Version
- File:
- Revision

## Sheet Real Time Clock.SchDoc: I2C Real Time Clock
size A4; ApprovedBy: Mehmet Günce Akkoyun; CheckedBy: Mehmet Günce Akkoyun; Author: Mehmet Günce Akkoyun; CompanyName: Ovoo Electronics; DrawnBy: Mehmet Günce Akkoyun; Engineer: Mehmet Günce Akkoyun; Organization: Ovoo Electronics; Address1: Necip Fazýl Mah. Ortaýrmak Sok.; Address2: Birgül Apt. No: 19/6; Address3: Meram / Konya; Address4: Turkiye; DocumentNumber: 51; Revision: R06; SheetNumber: 51; SheetTotal: 54
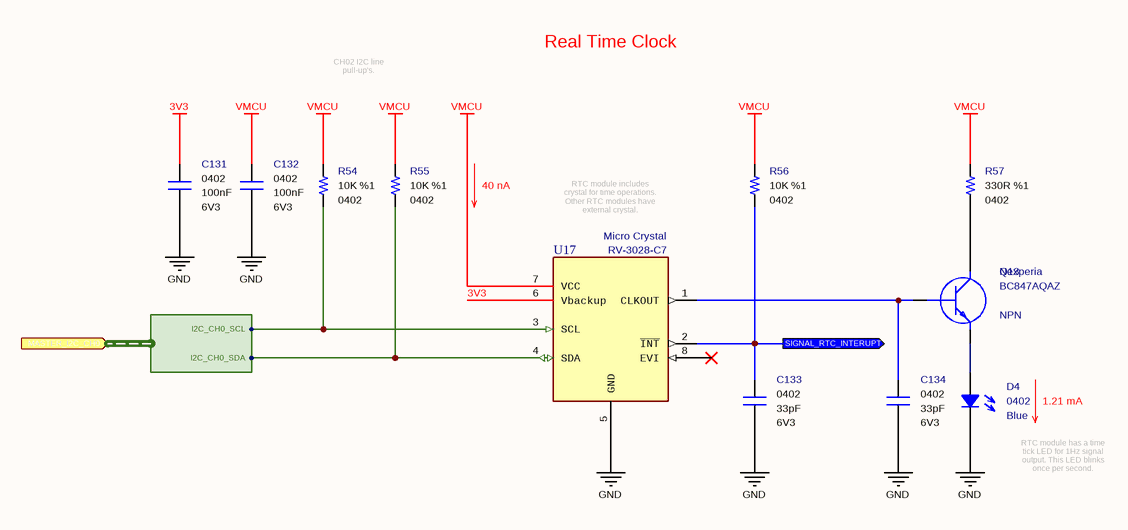
[diagram p25: Real Time Clock.SchDoc]

### Parts
C131  value 100nF  Case: 0402  Voltage: 6V3  [CAPACITOR_0402]  (hidden comment: Multilayer Ceramic Capacitor)
C132  value 100nF  Case: 0402  Voltage: 6V3  [CAPACITOR_0402]  (hidden comment: Multilayer Ceramic Capacitor)
C133  value 33pF  Case: 0402  Voltage: 6V3  [CAPACITOR_0402]  (hidden comment: Multilayer Ceramic Capacitor)
C134  value 33pF  Case: 0402  Voltage: 6V3  [CAPACITOR_0402]  (hidden comment: Multilayer Ceramic Capacitor)
D4  Case: 0402  Color: Blue  [LED_0402]  (hidden comment: SMD LED (Blue))
Q13  Polarity: NPN  Manufacturer Name: Nexperia  Manufacturer Part Number: BC847AQAZ  [SOT1215]  (hidden comment: Bipolar NPN Transistors)
R54  value 10K  Tolerance: %1  Case: 0402  [RESISTOR_0402]  (hidden comment: Thick Film Resistor)
R55  value 10K  Tolerance: %1  Case: 0402  [RESISTOR_0402]  (hidden comment: Thick Film Resistor)
R56  value 10K  Tolerance: %1  Case: 0402  [RESISTOR_0402]  (hidden comment: Thick Film Resistor)
R57  value 330R  Tolerance: %1  Case: 0402  [RESISTOR_0402]  (hidden comment: Thick Film Resistor)
U17  Manufacturer Name: Micro Crystal  [RV-3028-C7]  (hidden comment: Real Time Clock)

### Ports
MASTER_I2C_CH0 (in, harness MASTER_I2C_CH0), SIGNAL_RTC_INTERUPT (out)

### Harnesses
MASTER_I2C_CH0: I2C_CH0_SDA, I2C_CH0_SCL

### Nets
3V3: C131.2 U17.6(Vbackup)
GND: C131.1 C132.1 C133.2 C134.2 D4.1 U17.5(GND)
VMCU: C132.2 R54.2 R55.2 R56.2 R57.2 U17.7(VCC)
NetC133_1: C133.1 R56.1 U17.2(~{INT}) ; port SIGNAL_RTC_INTERUPT
NetC134_1: C134.1 Q13.1(B) U17.1(CLKOUT)
NetD4_2: D4.2 Q13.2(E)
NetQ13_3: Q13.3(C) R57.1
NetR54_1: R54.1 U17.3(SCL) ; port MASTER_I2C_CH0.I2C_CH0_SCL
NetR55_1: R55.1 U17.4(SDA) ; port MASTER_I2C_CH0.I2C_CH0_SDA

Not connected (* = marked no-connect by the designer): U17 8(EVI)*

### Notes on the sheet
- Real Time Clock
- CH02 I2C line pull-up's.
- 40 nA
- RTC module includes crystal for time operations. Other RTC modules have external crystal.
- 1.21 mA
- RTC module has a time tick LED for 1Hz signal output. This LED blinks once per second.
- Engineer
- All Rights are reserved to Customer and Engineer. [2021]
- Size:
- Date:
- A4
- Project :
- Time:
- Sheet
- of
- Customer
- Product ID
- Module ID
- Version
- File:
- Revision

### Library data of the parts
C131 C132 = Capacitor - 100nF [0402-6V3]: as C64-C66 on sheet FOTA MicroController; Height: 0.25mm; ComponentLink1Description: Mouser; ComponentLink1URL: https://www.mouser.com.tr/ProductDetail/AVX/04026D104KAT4A?qs=sGAEpiMZZMs0AnBnWHyRQPg4iYkCw7IMED%2F4kpqgf7w%3D; ComponentLink2Description: DataSheet; ComponentLink2URL: https://www.mouser.com.tr/datasheet/2/40/cx5r-776519.pdf; ROHS: Yes; Maximum Operating Temperature: +85; Minimum Operating Temperature: -55; Supplier 1: Avnet; Supplier Part Number 1: 04026D104KAT4A; Mouser Part Number: 581-04026D104KAT4A
C133 C134 = Capacitor - 33pF [0402-6V3]: as C67-C73 on sheet FOTA MicroController; Height: 0.5mm; Maximum Operating Temperature: +125; Minimum Operating Temperature: -55; ROHS: Yes; ComponentLink1Description: DataSheet; ComponentLink1URL: https://api.kemet.com/component-edge/download/datasheet/C0402C330J9RACAUTO.pdf; ComponentLink2Description: Mouser; ComponentLink2URL: https://www.mouser.com/Search/Refine.aspx?Keyword=80-C0402C330J9RAUTO; Supplier 1: Mouser; Supplier Part Number 1: 80-C0402C330J9RAUTO; Mouser Part Number: 80-C0402C330J9RAUTO
D4 = Diode - LED (0402-Blue): Standard LEDs - SMD PICOLEDTM;BLUE LED; 25M @ 5MA; Manufacturer Name: ROHM Semiconductor; Manufacturer Part Number: SMLP13BC8TT86; ROHS: Yes; ComponentLink1Description: DataSheet; ComponentLink1URL: https://d1d2qsbl8m0m72.cloudfront.net/en/products/databook/datasheet/opto/led/chip_mono/sml-p1-e.pdf; ComponentLink2Description: Mouser; ComponentLink2URL: https://www.mouser.com.tr/ProductDetail/ROHM-Semiconductor/SMLP13BC8TT86?qs=%2Fha2pyFaduidYDgXFKL%252BNZwCVZNUI4FlyPWWbVDx1b6ABmzS%252BS2f0w%3D%3D; Supplier 1: Mouser; Supplier 2: Digi-Key; Supplier Part Number 1: 755-SMLP13BC8TT86; Supplier Part Number 2: 846-1112-1-ND; Mouser Part Number: 755-SMLP13BC8TT86
Q13 = Transistor - BC847: as Q7-Q9 on sheet FOTA MicroController; ComponentLink1Description: DataSheet; ComponentLink1URL: https://www.mouser.com.tr/datasheet/2/916/BC847XQA_SER-1598405.pdf; ComponentLink2Description: Mouser; ComponentLink2URL: https://www.mouser.com.tr/ProductDetail/Nexperia/BC847AQAZ?qs=%2Fha2pyFaduhKMCPKNtQimeJpXTw9z4AqURd2YARs8DVICZNv3AT9Dw%3D%3D; Case: DFN-1010D-3; Supplier 1: Mouser; Supplier 2: Digi-Key; Supplier Part Number 1: 771-BC847AQAZ; Supplier Part Number 2: 1727-2545-1-ND; Mouser Part Number: 771-BC847AQAZ
R54-R56 = Resistor - 10K: as R36 on sheet FOTA MicroController; Height: 0.4mm; ComponentLink1Description: DataSheet; ComponentLink1URL: https://www.mouser.com.tr/datasheet/2/427/dcrcwe3-1762152.pdf; ComponentLink2Description: Mouser; ComponentLink2URL: https://www.mouser.com.tr/ProductDetail/Vishay-Dale/CRCW040210K0FKED?qs=sGAEpiMZZMu61qfTUdNhG2DpbjADlD3GcalbOv9utCY%3D; Supplier 1: Mouser; Supplier 2: Digi-Key; Supplier Part Number 1: 71-CRCW040210K0FKEDH; Supplier Part Number 2: 541-10.0KYCT-ND; Mouser Part Number: 71-CRCW0402-10K-E3
R57 = Resistor - 330R: as R31 on sheet FOTA MicroController; Height: 0.4mm; ComponentLink1Description: DataSheet; ComponentLink1URL: https://www.mouser.com.tr/datasheet/2/427/dcrcwe3-1762152.pdf; ComponentLink2Description: Mouser; ComponentLink2URL: https://www.mouser.com.tr/ProductDetail/Vishay-Dale/CRCW0402330RFKED?qs=sGAEpiMZZMu61qfTUdNhG2DpbjADlD3GGS6SwBlLi5Q%3D; Supplier 1: Mouser; Supplier 2: Digi-Key; Supplier Part Number 2: 541-330LCT-ND; Supplier Part Number 1: 71-CRCW0402-330-E3; Mouser Part Number: 71-CRCW0402-330-E3
U17 = IC - RV-3028-C7: Real Time Clock 32.768kHz I2C Time Acc. 1ppm; ComponentLink1Description: DataSheet; ComponentLink1URL: https://eu.mouser.com/datasheet/2/530/RV-3028-C7-1524919.pdf; ComponentLink2Description: Mouser; ComponentLink2URL: https://eu.mouser.com/ProductDetail/Micro-Crystal/RV-3028-C7-32768kHz-1ppm-TA-QC?qs=sGAEpiMZZMtpeOq%2F1QMb1b6mUOvJOzpDTOpQRtK3%252B9k%3D; Minimum Operating Temperature: -40; Maximum Operating Temperature: +85; Supplier 1: Digi-Key; Supplier Part Number 1: 2195-RV-3028-C732.768KHZ1PPM-TA-QCCT-ND; Case: SMD; Mouser Part Number: 428-203591-MG01; Manufacturer Part Number: RV-3028-C7

## Sheet Filter Capacitors - Signal IoT.SchDoc: Signal IoT Filter Capacitors
size A4; ApprovedBy: Mehmet Günce Akkoyun; CheckedBy: Mehmet Günce Akkoyun; Author: Mehmet Günce Akkoyun; CompanyName: Ovoo Electronics; DrawnBy: Mehmet Günce Akkoyun; Engineer: Mehmet Günce Akkoyun; Organization: Ovoo Electronics; Address1: Necip Fazýl Mah. Ortaýrmak Sok.; Address2: Birgül Apt. No: 19/6; Address3: Meram / Konya; Address4: Turkiye; DocumentNumber: 36; Revision: R06; SheetNumber: 36; SheetTotal: 54
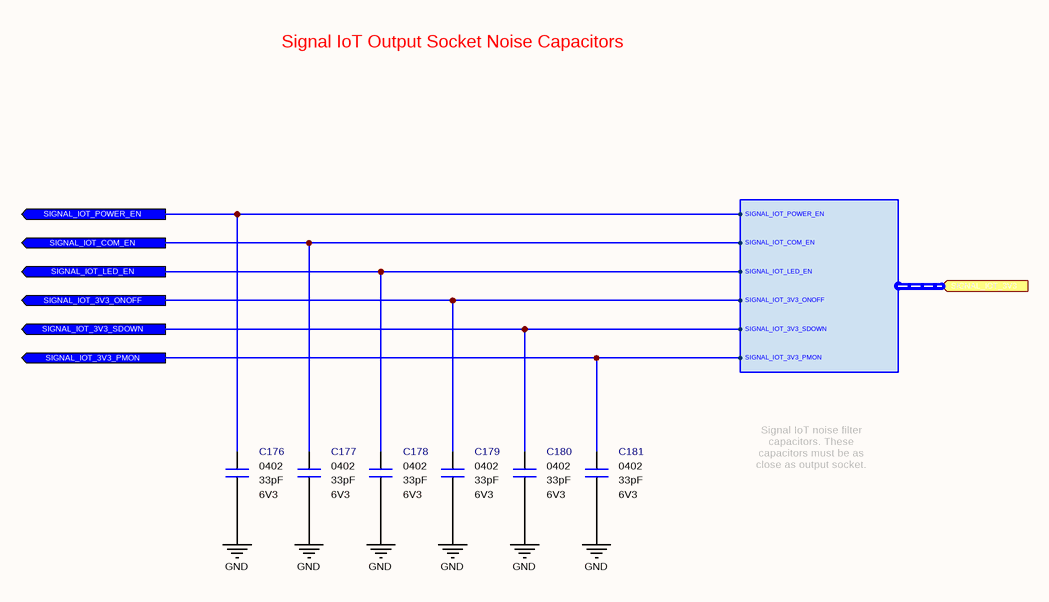
[diagram p26: Filter Capacitors - Signal IoT.SchDoc]

### Parts
C176  value 33pF  Case: 0402  Voltage: 6V3  [CAPACITOR_0402]  (hidden comment: Multilayer Ceramic Capacitor)
C177  value 33pF  Case: 0402  Voltage: 6V3  [CAPACITOR_0402]  (hidden comment: Multilayer Ceramic Capacitor)
C178  value 33pF  Case: 0402  Voltage: 6V3  [CAPACITOR_0402]  (hidden comment: Multilayer Ceramic Capacitor)
C179  value 33pF  Case: 0402  Voltage: 6V3  [CAPACITOR_0402]  (hidden comment: Multilayer Ceramic Capacitor)
C180  value 33pF  Case: 0402  Voltage: 6V3  [CAPACITOR_0402]  (hidden comment: Multilayer Ceramic Capacitor)
C181  value 33pF  Case: 0402  Voltage: 6V3  [CAPACITOR_0402]  (hidden comment: Multilayer Ceramic Capacitor)

### Ports
SIGNAL_IOT_3V3 (in, harness SIGNAL_IOT_3V3), SIGNAL_IOT_3V3_ONOFF (out), SIGNAL_IOT_3V3_PMON (out), SIGNAL_IOT_3V3_SDOWN (out), SIGNAL_IOT_COM_EN (out), SIGNAL_IOT_LED_EN (out), SIGNAL_IOT_POWER_EN (out)

### Harnesses
SIGNAL_IOT_3V3: SIGNAL_IOT_COM_EN, SIGNAL_IOT_POWER_EN, SIGNAL_IOT_LED_EN, SIGNAL_IOT_3V3_SDOWN, SIGNAL_IOT_3V3_ONOFF, SIGNAL_IOT_3V3_PMON

### Nets
GND: C176.1 C177.1 C178.1 C179.1 C180.1 C181.1
NetC176_2: C176.2 ; port SIGNAL_IOT_POWER_EN, port SIGNAL_IOT_3V3.SIGNAL_IOT_POWER_EN
NetC177_2: C177.2 ; port SIGNAL_IOT_COM_EN, port SIGNAL_IOT_3V3.SIGNAL_IOT_COM_EN
NetC178_2: C178.2 ; port SIGNAL_IOT_LED_EN, port SIGNAL_IOT_3V3.SIGNAL_IOT_LED_EN
NetC179_2: C179.2 ; port SIGNAL_IOT_3V3_ONOFF, port SIGNAL_IOT_3V3.SIGNAL_IOT_3V3_ONOFF
NetC180_2: C180.2 ; port SIGNAL_IOT_3V3_SDOWN, port SIGNAL_IOT_3V3.SIGNAL_IOT_3V3_SDOWN
NetC181_2: C181.2 ; port SIGNAL_IOT_3V3_PMON, port SIGNAL_IOT_3V3.SIGNAL_IOT_3V3_PMON

### Notes on the sheet
- Signal IoT Output Socket Noise Capacitors
- Signal IoT noise filter capacitors. These capacitors must be as close as output socket.
- Engineer
- All Rights are reserved to Customer and Engineer. [2021]
- Size:
- Date:
- A4
- Project :
- Time:
- Sheet
- of
- Customer
- Product ID
- Module ID
- Version
- File:
- Revision

### Library data of the parts
C176-C181 = Capacitor - 33pF [0402-6V3]: as C67-C73 on sheet FOTA MicroController; Height: 0.5mm; Maximum Operating Temperature: +125; Minimum Operating Temperature: -55; ROHS: Yes; ComponentLink1Description: DataSheet; ComponentLink1URL: https://api.kemet.com/component-edge/download/datasheet/C0402C330J9RACAUTO.pdf; ComponentLink2Description: Mouser; ComponentLink2URL: https://www.mouser.com/Search/Refine.aspx?Keyword=80-C0402C330J9RAUTO; Supplier 1: Mouser; Supplier Part Number 1: 80-C0402C330J9RAUTO; Mouser Part Number: 80-C0402C330J9RAUTO

## Sheet Filter Capacitors - IoT UART.SchDoc: IoT UART Filter Capacitors
size A4; ApprovedBy: Mehmet Günce Akkoyun; CheckedBy: Mehmet Günce Akkoyun; Author: Mehmet Günce Akkoyun; CompanyName: Ovoo Electronics; DrawnBy: Mehmet Günce Akkoyun; Engineer: Mehmet Günce Akkoyun; Organization: Ovoo Electronics; Address1: Necip Fazýl Mah. Ortaýrmak Sok.; Address2: Birgül Apt. No: 19/6; Address3: Meram / Konya; Address4: Turkiye; DocumentNumber: 39; Revision: R06; SheetNumber: 39; SheetTotal: 54
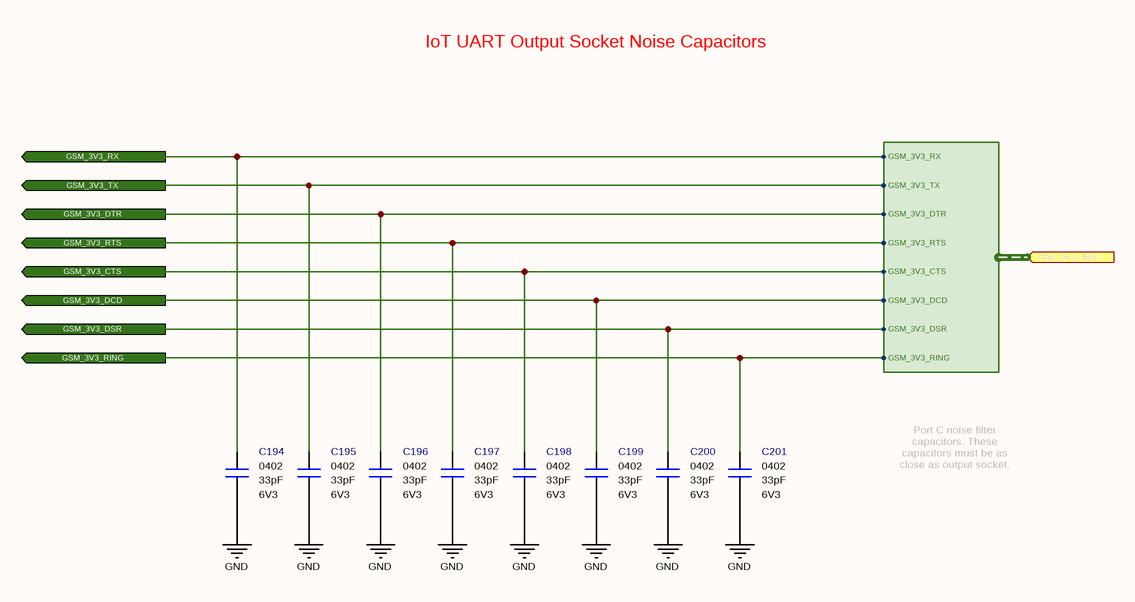
[diagram p27: Filter Capacitors - IoT UART.SchDoc]

### Parts
C194  value 33pF  Case: 0402  Voltage: 6V3  [CAPACITOR_0402]  (hidden comment: Multilayer Ceramic Capacitor)
C195  value 33pF  Case: 0402  Voltage: 6V3  [CAPACITOR_0402]  (hidden comment: Multilayer Ceramic Capacitor)
C196  value 33pF  Case: 0402  Voltage: 6V3  [CAPACITOR_0402]  (hidden comment: Multilayer Ceramic Capacitor)
C197  value 33pF  Case: 0402  Voltage: 6V3  [CAPACITOR_0402]  (hidden comment: Multilayer Ceramic Capacitor)
C198  value 33pF  Case: 0402  Voltage: 6V3  [CAPACITOR_0402]  (hidden comment: Multilayer Ceramic Capacitor)
C199  value 33pF  Case: 0402  Voltage: 6V3  [CAPACITOR_0402]  (hidden comment: Multilayer Ceramic Capacitor)
C200  value 33pF  Case: 0402  Voltage: 6V3  [CAPACITOR_0402]  (hidden comment: Multilayer Ceramic Capacitor)
C201  value 33pF  Case: 0402  Voltage: 6V3  [CAPACITOR_0402]  (hidden comment: Multilayer Ceramic Capacitor)

### Ports
GSM_3V3_CTS (out), GSM_3V3_DCD (out), GSM_3V3_DSR (out), GSM_3V3_DTR (out), GSM_3V3_RING (out), GSM_3V3_RTS (out), GSM_3V3_RX (out), GSM_3V3_TX (out), GSM_3V3_UART (in, harness GSM_3V3_UART)

### Harnesses
GSM_3V3_UART: GSM_3V3_RX, GSM_3V3_TX, GSM_3V3_DTR, GSM_3V3_RTS, GSM_3V3_CTS, GSM_3V3_DCD, GSM_3V3_DSR, GSM_3V3_RING

### Nets
GND: C194.1 C195.1 C196.1 C197.1 C198.1 C199.1 C200.1 C201.1
NetC194_2: C194.2 ; port GSM_3V3_RX, port GSM_3V3_UART.GSM_3V3_RX
NetC195_2: C195.2 ; port GSM_3V3_TX, port GSM_3V3_UART.GSM_3V3_TX
NetC196_2: C196.2 ; port GSM_3V3_DTR, port GSM_3V3_UART.GSM_3V3_DTR
NetC197_2: C197.2 ; port GSM_3V3_RTS, port GSM_3V3_UART.GSM_3V3_RTS
NetC198_2: C198.2 ; port GSM_3V3_CTS, port GSM_3V3_UART.GSM_3V3_CTS
NetC199_2: C199.2 ; port GSM_3V3_DCD, port GSM_3V3_UART.GSM_3V3_DCD
NetC200_2: C200.2 ; port GSM_3V3_DSR, port GSM_3V3_UART.GSM_3V3_DSR
NetC201_2: C201.2 ; port GSM_3V3_RING, port GSM_3V3_UART.GSM_3V3_RING

### Notes on the sheet
- IoT UART Output Socket Noise Capacitors
- Port C noise filter capacitors. These capacitors must be as close as output socket.
- Engineer
- All Rights are reserved to Customer and Engineer. [2021]
- Size:
- Date:
- A4
- Project :
- Time:
- Sheet
- of
- Customer
- Product ID
- Module ID
- Version
- File:
- Revision

### Library data of the parts
C194-C201 = Capacitor - 33pF [0402-6V3]: as C67-C73 on sheet FOTA MicroController; Height: 0.5mm; Maximum Operating Temperature: +125; Minimum Operating Temperature: -55; ROHS: Yes; ComponentLink1Description: DataSheet; ComponentLink1URL: https://api.kemet.com/component-edge/download/datasheet/C0402C330J9RACAUTO.pdf; ComponentLink2Description: Mouser; ComponentLink2URL: https://www.mouser.com/Search/Refine.aspx?Keyword=80-C0402C330J9RAUTO; Supplier 1: Mouser; Supplier Part Number 1: 80-C0402C330J9RAUTO; Mouser Part Number: 80-C0402C330J9RAUTO

## Sheet Filter Capacitors - Port F.SchDoc: PORT F Filter Capacitors
size A4; ApprovedBy: Mehmet Günce Akkoyun; CheckedBy: Mehmet Günce Akkoyun; Author: Mehmet Günce Akkoyun; CompanyName: Ovoo Electronics; DrawnBy: Mehmet Günce Akkoyun; Engineer: Mehmet Günce Akkoyun; Organization: Ovoo Electronics; Address1: Necip Fazýl Mah. Ortaýrmak Sok.; Address2: Birgül Apt. No: 19/6; Address3: Meram / Konya; Address4: Turkiye; DocumentNumber: 40; Revision: R06; SheetNumber: 40; SheetTotal: 54
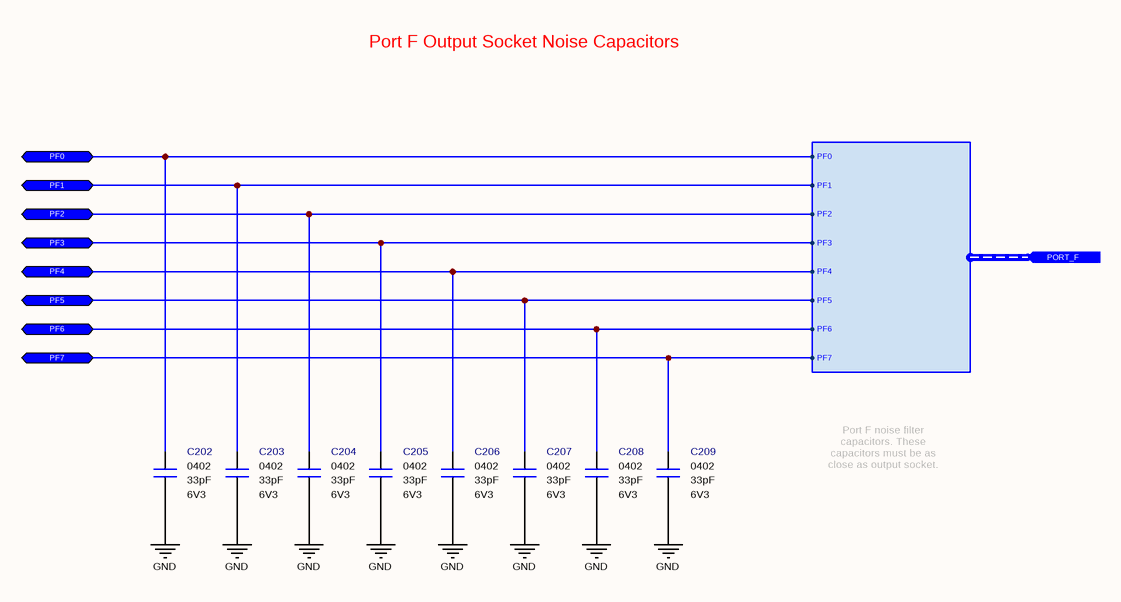
[diagram p28: Filter Capacitors - Port F.SchDoc]

### Parts
C202  value 33pF  Case: 0402  Voltage: 6V3  [CAPACITOR_0402]  (hidden comment: Multilayer Ceramic Capacitor)
C203  value 33pF  Case: 0402  Voltage: 6V3  [CAPACITOR_0402]  (hidden comment: Multilayer Ceramic Capacitor)
C204  value 33pF  Case: 0402  Voltage: 6V3  [CAPACITOR_0402]  (hidden comment: Multilayer Ceramic Capacitor)
C205  value 33pF  Case: 0402  Voltage: 6V3  [CAPACITOR_0402]  (hidden comment: Multilayer Ceramic Capacitor)
C206  value 33pF  Case: 0402  Voltage: 6V3  [CAPACITOR_0402]  (hidden comment: Multilayer Ceramic Capacitor)
C207  value 33pF  Case: 0402  Voltage: 6V3  [CAPACITOR_0402]  (hidden comment: Multilayer Ceramic Capacitor)
C208  value 33pF  Case: 0402  Voltage: 6V3  [CAPACITOR_0402]  (hidden comment: Multilayer Ceramic Capacitor)
C209  value 33pF  Case: 0402  Voltage: 6V3  [CAPACITOR_0402]  (hidden comment: Multilayer Ceramic Capacitor)

### Ports
PF0 (bidir), PF1 (bidir), PF2 (bidir), PF3 (bidir), PF4 (bidir), PF5 (bidir), PF6 (bidir), PF7 (bidir), PORT_F (in, harness PORT_F)

### Harnesses
PORT_F: PF0, PF1, PF2, PF3, PF4, PF5, PF7, PF6

### Nets
GND: C202.1 C203.1 C204.1 C205.1 C206.1 C207.1 C208.1 C209.1
NetC202_2: C202.2 ; port PF0, port PORT_F.PF0
NetC203_2: C203.2 ; port PF1, port PORT_F.PF1
NetC204_2: C204.2 ; port PF2, port PORT_F.PF2
NetC205_2: C205.2 ; port PF3, port PORT_F.PF3
NetC206_2: C206.2 ; port PF4, port PORT_F.PF4
NetC207_2: C207.2 ; port PF5, port PORT_F.PF5
NetC208_2: C208.2 ; port PF6, port PORT_F.PF6
NetC209_2: C209.2 ; port PF7, port PORT_F.PF7

### Notes on the sheet
- Port F Output Socket Noise Capacitors
- Port F noise filter capacitors. These capacitors must be as close as output socket.
- Engineer
- All Rights are reserved to Customer and Engineer. [2021]
- Size:
- Date:
- A4
- Project :
- Time:
- Sheet
- of
- Customer
- Product ID
- Module ID
- Version
- File:
- Revision

### Library data of the parts
C202-C209 = Capacitor - 33pF [0402-6V3]: as C67-C73 on sheet FOTA MicroController; Height: 0.5mm; Maximum Operating Temperature: +125; Minimum Operating Temperature: -55; ROHS: Yes; ComponentLink1Description: DataSheet; ComponentLink1URL: https://api.kemet.com/component-edge/download/datasheet/C0402C330J9RACAUTO.pdf; ComponentLink2Description: Mouser; ComponentLink2URL: https://www.mouser.com/Search/Refine.aspx?Keyword=80-C0402C330J9RAUTO; Supplier 1: Mouser; Supplier Part Number 1: 80-C0402C330J9RAUTO; Mouser Part Number: 80-C0402C330J9RAUTO

## Nets that join several sheets
3V3: Main Power Switch (C12.1 U2.1), Real Time Clock (C131.2 U17.6)
3V8: 3V8 Buck Boost Converter (6 pins), GSM Power (C5.1 U1.1)
GND: 3V8 Buck Boost Converter (10 pins), 5V Buck Boost Converter (12 pins), GSM Power (11 pins), Main Power Switch (5 pins), GE910QUAD Modem (51 pins), GSM LED Indicators (12 pins), Master MicroController Core (13 pins), FOTA MicroController (23 pins), SD Card (7 pins), ICSP Burn Buffer (5 pins), Real Time Clock (6 pins), Filter Capacitors - Signal IoT (6 pins), Filter Capacitors - IoT UART (8 pins), Filter Capacitors - Port F (8 pins)
VCC: 3V8 Buck Boost Converter (5 pins), 5V Buck Boost Converter (C228.2 C229.1 C230.1 U22.10)
VFOTA: FOTA MicroController (9 pins), ICSP Burn Buffer (C80.2 U13.19)
VIOT1: GSM Power (C1.1 C2.2 C3.2 FB1.2), GE910QUAD Modem (U4.M01 U4.M02)
VIOT2: GSM Power (C7.1 C8.2 C9.2 FB2.2), GE910QUAD Modem (U4.N01 U4.N02 U4.P01 U4.P02)
VMCU: Main Power Switch (C10.1 R3.1 U2.6), GSM LED Indicators (C54.1 Q3.2 R17.2), Master MicroController Core (10 pins), SD Card (8 pins), ICSP Burn Buffer (C81.2 U13.2), Real Time Clock (6 pins)

## Assembly variants
Prototype: not fitted C23 C24 C96 C97 C99 C101 C182 C183 C184 C185 C186 C187 C188 C189 C190 C191 C192 C193 C194 C195 C196 C197 C198 C199 C200 C201 C202 C203 C204 C205 C206 C207 C208 C209 C210 C211 C212 C213 C214 C215 C216 C217 C218 C219 C220 C221 C222 C223 C224 C225 C226 C227 C228 C229 C230 C231 C232 C233 C234 C235 C236 C237 C238 C239 C240 C241 C242 C243 C244 C245 C246 C247 C248 C249 C250 C251 C252 C253 C254 C255 C256 C257 C258 C259 C260 C261 C262 C263 C264 C265 D3 L1 L2 Q10 Q11 Q12 R46 R48 R50
Bulk Production: not fitted C54 C55 C56 C57 C58 C59 C68 C69 C71 C73 C102 C103 C104 C105 C106 C107 C108 C109 C110 C111 C112 C113 C114 C115 C116 C117 C118 C119 C120 C121 C122 C123 C124 C125 C126 C127 C128 C129 C134 C138 C139 C140 C141 C142 C143 C144 C145 C146 C147 C148 C149 C150 C151 C152 C153 C154 C155 C156 C157 C158 C159 C160 C161 C162 C163 C164 C165 C166 C167 C168 C169 C170 C171 C172 C173 C174 C175 C176 C177 C178 C179 C180 C181 C182 C183 C184 C185 C186 C187 C188 C189 C190 C191 C192 C193 C194 C195 C196 C197 C198 C199 C200 C201 C202 C203 C204 C205 C206 C207 C208 C209 C210 C211 C212 C213 C214 C215 C216 C217 C218 C219 C220 C221 D1 D2 D4 Q3 Q4 Q5 Q6 Q7 Q8 Q9 Q13 R19 R20 R21 R22 R23 R24 R25 R26 R31 R32 R34 R57